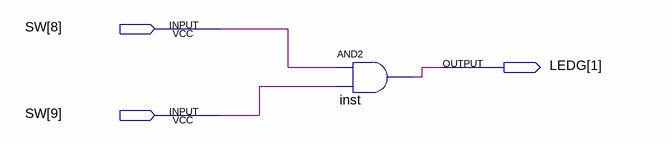
[diagram p0: schematic sheet]
// Quartus schematic LLDX.bdf as structural Verilog: 1 symbols, 3 pins
module LLDX (
  input  [9:8] SW,
  output [1:1] LEDG
);

  and inst (LEDG[1], SW[8], SW[9]);
endmodule
